# Altium schematic sheet 02 POWER.SchDoc: POWER
size 420 x 297 mm; SheetNumber: 2; SheetTotal: 6
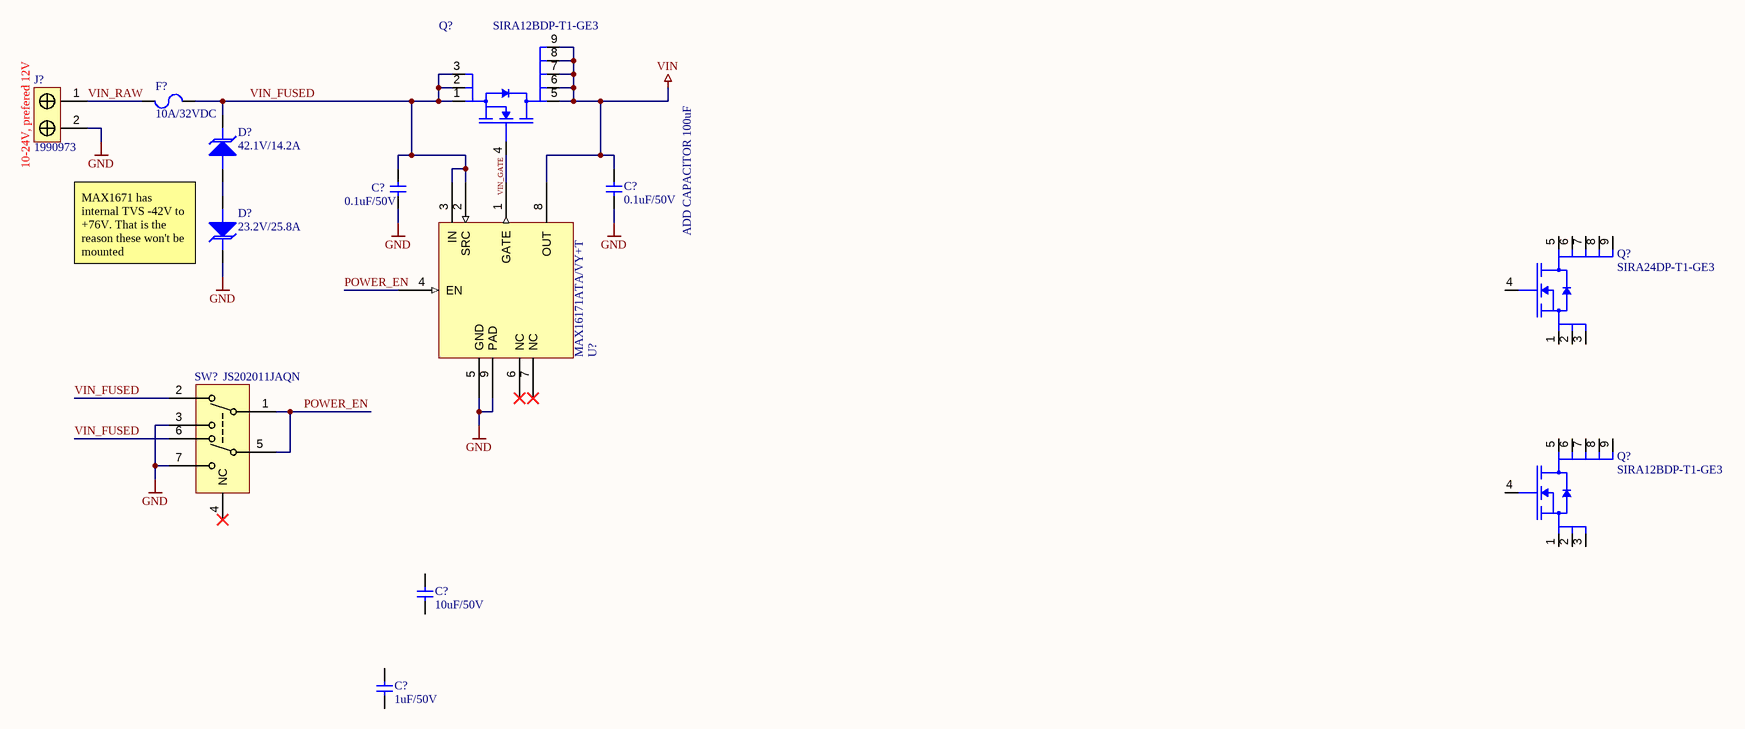
[diagram p0: 02 POWER.SchDoc]

## Parts
(Parts that share a designator on the sheet are numbered #1, #2 ... from top to bottom, then left to right.)
C?#1  0.1uF/50V  [CAPC1005X06N]
C?#2  0.1uF/50V  [CAPC1005X06N]
C?#3  10uF/50V  [CAPC3216X18N]
C?#4  1uF/50V  [INDC1608X10N]
D?#1  42.1V/14.2A  [DIOM4739X26N]
D?#2  23.2V/25.8A  [DIOM4739X26N]
F?  10A/32VDC  [FUSE3216X08N]
J?  1990973  [1990973]
Q?#1  SIRA12BDP-T1-GE3  [POWERPAK-SO-8-Single]
Q?#2  SIRA24DP-T1-GE3  [POWERPAK-SO-8-Single]
Q?#3  SIRA12BDP-T1-GE3  [POWERPAK-SO-8-Single]
SW?  JS202011JAQN  [JS202011JAQN]
U?  MAX16171ATA/VY+T  [PSON50P300X80_HS-9N]

## Nets
GND: C?#1.2 C?#2.1 D?#2.1 J?.2 SW?.3 SW?.7 U?.5(GND) U?.9(PAD)
VIN: C?#2.2 Q?#1.5 Q?#1.6 Q?#1.7 Q?#1.8 Q?#1.9 U?.8(OUT)
POWER_EN: SW?.1 U?.4(EN)
VIN_FUSED: C?#1.1 D?#1.1 F?.2 Q?#1.1 Q?#1.2 Q?#1.3 SW?.2 SW?.6 U?.2(SRC) U?.3(IN)
VIN_RAW: F?.1 J?.1
NetD?#1_2: D?#1.2 D?#2.2
NetQ?#1_4: Q?#1.4 U?.1(GATE)

Not connected (* = marked no-connect by the designer): C?#3 1 2; C?#4 1 2; Q?#2 1 2 3 4 5 6 7 8 9; Q?#3 1 2 3 4 5 6 7 8 9; SW? 4(NC)* 5; U? 6(NC)* 7(NC)*

## Notes on the sheet
- (near J?) 10-24V, prefered 12V
- ADD CAPACITOR 100uF
- (near D?#2) MAX1671 has internal TVS -42V to +76V. That is the reason these won't be mounted
- Labels drawn without touching a wire or pin: VIN_GATE
- Title
- Project
- Size
- Date
- Revision
- A3
- Designed By

## Library data of the parts
C?#1 C?#2 = GCM1555C1H101JA16D: 100 pF ±5% 50V Ceramic Capacitor C0G, NP0 0402 (1005 Metric); manufacturer: Murata Electronics; mfr_part_number: GCM1555C1H101JA16D; assembler_number: GCM1555C1H101JA16D; datasheet: https://www.murata.com/-/media/webrenewal/support/library/catalog/products/k35e.ashx?la=en-us&cvid=20200508021757000000
C?#3 = GRT31CR61H106ME01L: 10 µF ±20% 50V Ceramic Capacitor X5R 1206 (3216 Metric); manufacturer: Murata Electronics; mfr_part_number: GRT31CR61H106ME01L; assembler_number: GRT31CR61H106ME01L; datasheet: https://search.murata.co.jp/Ceramy/image/img/A01X/G101/ENG/GRT31CR61H106ME01-01.pdf
C?#4 = GRT188R61H105KE13D: 1 µF ±10% 50V Ceramic Capacitor X5R 0603 (1608 Metric); manufacturer: Murata Electronics; mfr_part_number: GRT188R61H105KE13D; assembler_number: GRT188R61H105KE13D; datasheet: https://search.murata.co.jp/Ceramy/image/img/A01X/G101/ENG/GRT188R61H105KE13-01.pdf
D?#1 = SMBJ26A-13-F: 42.1V Clamp 14.2A Ipp Tvs Diode Surface Mount SMB; manufacturer: Diodes Incorporated; mfr_part_number: SMBJ26A-13-F; assembler_number: SMBJ26A-13-F; datasheet: https://www.diodes.com/assets/Datasheets/ds19002.pdf
D?#2 = SMBJ14A-13-F: 23.2V Clamp 25.8A Ipp Tvs Diode Surface Mount SMB; manufacturer: Diodes Incorporated; mfr_part_number: SMBJ14A-13-F; assembler_number: SMBJ14A-13-F; datasheet: https://www.diodes.com/assets/Datasheets/ds19002.pdf
F? = 0685H9100-01: 10 A 125 V AC 32 V DC Fuse Board Mount (Cartridge Style Excluded) Surface Mount 1206 (3216 Metric); manufacturer: Bel Fuse Inc.; mfr_part_number: 0685H9100-01; assembler_number: 0685H9100-01; datasheet: https://www.belfuse.com/resources/datasheets/circuitprotection/ds-cp-c1h-series.pdf
J? = 1990973: 2 Position Wire to Board Terminal Block Horizontal with Board 0.197" (5.00mm) Through Hole; manufacturer: Phoenix Contact; mfr_part_number: 1990973; assembler_number: 1990973; datasheet: https://www.phoenixcontact.com/en-pc/products/pcb-terminal-block-spt-25-2-h-50-1990973
Q?#1 Q?#3 = SIRA12BDP-T1-GE3: N-Channel 30 V 27A (Ta), 60A (Tc) 5W (Ta), 38W (Tc) Surface Mount PowerPAK® SO-8; manufacturer: Vishay Siliconix; mfr_part_number: SIRA12BDP-T1-GE3; assembler_number: SIRA12BDP-T1-GE3; datasheet: https://www.vishay.com/docs/76390/sira12bdp.pdf
Q?#2 = SIRA24DP-T1-GE3: N-Channel 25 V 60A (Tc) 62.5W (Tc) Surface Mount PowerPAK® SO-8; manufacturer: Vishay Siliconix; mfr_part_number: SIRA24DP-T1-GE3; assembler_number: SIRA24DP-T1-GE3; datasheet: https://www.vishay.com/docs/75453/sira24dp.pdf
SW? = JS202011JAQN: Slide Switch DPDT Surface Mount, Right Angle; manufacturer: C&K; mfr_part_number: JS202011JAQN; assembler_number: JS202011JAQN; datasheet: https://www.ckswitches.com/media/1422/js.pdf
U? = MAX16171ATA/VY+T: OR Controller N+1 ORing Controller N-Channel 1:1 8-TDFN-CU (2x3); manufacturer: Analog Devices Inc./Maxim Integrated; mfr_part_number: MAX16171ATA/VY+T; assembler_number: MAX16171ATA/VY+T; datasheet: https://datasheets.maximintegrated.com/en/ds/MAX16171.pdf